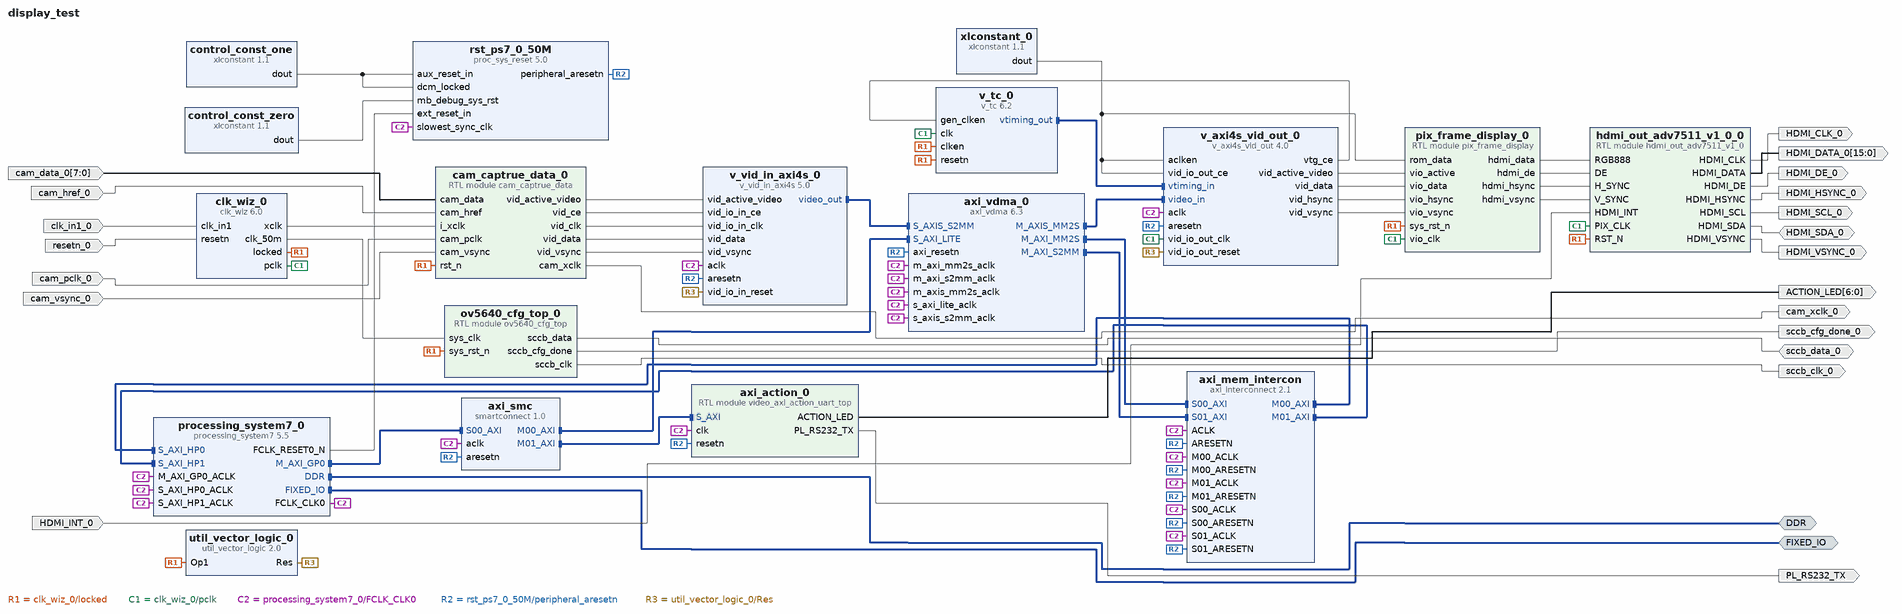
[diagram p0: block diagram of the top level]
# Vivado block design display_test, xc7z020clg484-1, Vivado 2025.2
create_bd_design display_test

create_bd_intf_port -mode Master -vlnv xilinx.com:interface:ddrx_rtl:1.0 DDR
create_bd_intf_port -mode Master -vlnv xilinx.com:display_processing_system7:fixedio_rtl:1.0 FIXED_IO
create_bd_port -dir O -type clk sccb_clk_0
create_bd_port -dir IO sccb_data_0
create_bd_port -dir O sccb_cfg_done_0
create_bd_port -dir I cam_vsync_0
create_bd_port -dir I cam_href_0
create_bd_port -dir I cam_pclk_0
create_bd_port -dir I -from 7 -to 0 cam_data_0
create_bd_port -dir I -type clk clk_in1_0
set_property -dict {CONFIG.FREQ_HZ 100000000} [get_bd_ports clk_in1_0]
create_bd_port -dir I -type rst resetn_0
create_bd_port -dir O cam_xclk_0
create_bd_port -dir O HDMI_SCL_0
create_bd_port -dir O HDMI_DE_0
create_bd_port -dir O -from 15 -to 0 HDMI_DATA_0
create_bd_port -dir I HDMI_INT_0
create_bd_port -dir O HDMI_VSYNC_0
create_bd_port -dir O HDMI_HSYNC_0
create_bd_port -dir O -type clk HDMI_CLK_0
set_property -dict {CONFIG.FREQ_HZ 25000000} [get_bd_ports HDMI_CLK_0]
create_bd_port -dir IO HDMI_SDA_0
create_bd_port -dir O PL_RS232_TX
create_bd_port -dir O -from 6 -to 0 ACTION_LED

create_bd_cell -type ip -vlnv xilinx.com:ip:processing_system7:5.5 processing_system7_0
set_property -dict [list \
  CONFIG.PCW_APU_PERIPHERAL_FREQMHZ 666.666666 \
  CONFIG.PCW_ENET0_ENET0_IO {MIO 16 .. 27} \
  CONFIG.PCW_ENET0_GRP_MDIO_ENABLE 1 \
  CONFIG.PCW_ENET0_GRP_MDIO_IO {MIO 52 .. 53} \
  CONFIG.PCW_ENET0_PERIPHERAL_ENABLE 1 \
  CONFIG.PCW_ENET0_RESET_ENABLE 1 \
  CONFIG.PCW_ENET0_RESET_IO {MIO 47} \
  CONFIG.PCW_ENET_RESET_ENABLE 1 \
  CONFIG.PCW_ENET_RESET_SELECT {Share reset pin} \
  CONFIG.PCW_FPGA0_PERIPHERAL_FREQMHZ 50 \
  CONFIG.PCW_FPGA1_PERIPHERAL_FREQMHZ 50 \
  CONFIG.PCW_GPIO_EMIO_GPIO_ENABLE 1 \
  CONFIG.PCW_GPIO_EMIO_GPIO_IO 2 \
  CONFIG.PCW_GPIO_EMIO_GPIO_WIDTH 2 \
  CONFIG.PCW_GPIO_MIO_GPIO_ENABLE 1 \
  CONFIG.PCW_GPIO_MIO_GPIO_IO MIO \
  CONFIG.PCW_I2C_RESET_ENABLE 1 \
  CONFIG.PCW_PERIPHERAL_BOARD_PRESET None \
  CONFIG.PCW_PRESET_BANK1_VOLTAGE {LVCMOS 1.8V} \
  CONFIG.PCW_QSPI_PERIPHERAL_ENABLE 0 \
  CONFIG.PCW_SD0_GRP_CD_ENABLE 1 \
  CONFIG.PCW_SD0_GRP_CD_IO {MIO 0} \
  CONFIG.PCW_SD0_GRP_WP_ENABLE 0 \
  CONFIG.PCW_SD0_PERIPHERAL_ENABLE 1 \
  CONFIG.PCW_SD0_SD0_IO {MIO 40 .. 45} \
  CONFIG.PCW_SDIO_PERIPHERAL_FREQMHZ 100 \
  CONFIG.PCW_UART1_PERIPHERAL_ENABLE 1 \
  CONFIG.PCW_UART1_UART1_IO {MIO 48 .. 49} \
  CONFIG.PCW_UART_PERIPHERAL_FREQMHZ 100 \
  CONFIG.PCW_UIPARAM_DDR_FREQ_MHZ 533.333333 \
  CONFIG.PCW_UIPARAM_DDR_PARTNO {MT41K256M16 RE-15E} \
  CONFIG.PCW_USB0_PERIPHERAL_ENABLE 0 \
  CONFIG.PCW_USB_RESET_ENABLE 1 \
  CONFIG.PCW_USE_S_AXI_HP0 1 \
  CONFIG.PCW_USE_S_AXI_HP1 1 \
  CONFIG.preset None \
] [get_bd_cells processing_system7_0]
# 497 more settings of processing_system7_0 are not shown: defaults, MIO pin electricals, DDR timing, and values the tool derives
create_bd_cell -type module -reference ov5640_cfg_top ov5640_cfg_top_0
create_bd_cell -type module -reference cam_captrue_data cam_captrue_data_0
create_bd_cell -type ip -vlnv xilinx.com:ip:axi_vdma:6.3 axi_vdma_0
set_property -dict [list \
  CONFIG.c_m_axis_mm2s_tdata_width 24 \
  CONFIG.c_mm2s_linebuffer_depth 1024 \
  CONFIG.c_s2mm_linebuffer_depth 1024 \
] [get_bd_cells axi_vdma_0]
create_bd_cell -type ip -vlnv xilinx.com:ip:v_vid_in_axi4s:5.0 v_vid_in_axi4s_0
set_property -dict {CONFIG.C_ADDR_WIDTH 13 CONFIG.C_HAS_ASYNC_CLK 1} [get_bd_cells v_vid_in_axi4s_0]
create_bd_cell -type ip -vlnv xilinx.com:ip:v_axi4s_vid_out:4.0 v_axi4s_vid_out_0
set_property -dict {CONFIG.C_ADDR_WIDTH 13 CONFIG.C_HAS_ASYNC_CLK 1} [get_bd_cells v_axi4s_vid_out_0]
create_bd_cell -type module -reference pix_frame_display pix_frame_display_0
create_bd_cell -type ip -vlnv xilinx.com:ip:clk_wiz:6.0 clk_wiz_0
set_property -dict [list \
  CONFIG.CLKIN1_JITTER_PS 100.0 \
  CONFIG.CLKOUT1_DRIVES BUFG \
  CONFIG.CLKOUT1_JITTER 172.753 \
  CONFIG.CLKOUT1_PHASE_ERROR 150.621 \
  CONFIG.CLKOUT1_REQUESTED_OUT_FREQ 25 \
  CONFIG.CLKOUT2_DRIVES BUFG \
  CONFIG.CLKOUT2_JITTER 126.824 \
  CONFIG.CLKOUT2_PHASE_ERROR 150.621 \
  CONFIG.CLKOUT2_REQUESTED_OUT_FREQ 125 \
  CONFIG.CLKOUT2_USED true \
  CONFIG.CLKOUT3_DRIVES BUFG \
  CONFIG.CLKOUT3_JITTER 174.298 \
  CONFIG.CLKOUT3_PHASE_ERROR 150.621 \
  CONFIG.CLKOUT3_REQUESTED_OUT_FREQ 24 \
  CONFIG.CLKOUT3_USED true \
  CONFIG.CLKOUT4_DRIVES BUFG \
  CONFIG.CLKOUT4_JITTER 149.175 \
  CONFIG.CLKOUT4_PHASE_ERROR 150.621 \
  CONFIG.CLKOUT4_REQUESTED_OUT_FREQ 50 \
  CONFIG.CLKOUT4_USED true \
  CONFIG.CLKOUT5_DRIVES BUFG \
  CONFIG.CLKOUT6_DRIVES BUFG \
  CONFIG.CLKOUT7_DRIVES BUFG \
  CONFIG.CLK_OUT1_PORT pclk \
  CONFIG.CLK_OUT2_PORT pclk_x5 \
  CONFIG.CLK_OUT3_PORT xclk \
  CONFIG.CLK_OUT4_PORT clk_50m \
  CONFIG.MMCM_BANDWIDTH OPTIMIZED \
  CONFIG.MMCM_CLKFBOUT_MULT_F 25 \
  CONFIG.MMCM_CLKIN1_PERIOD 10.000 \
  CONFIG.MMCM_CLKIN2_PERIOD 10.000 \
  CONFIG.MMCM_CLKOUT0_DIVIDE_F 50 \
  CONFIG.MMCM_CLKOUT1_DIVIDE 10 \
  CONFIG.MMCM_CLKOUT2_DIVIDE 52 \
  CONFIG.MMCM_CLKOUT3_DIVIDE 25 \
  CONFIG.MMCM_COMPENSATION ZHOLD \
  CONFIG.MMCM_DIVCLK_DIVIDE 2 \
  CONFIG.NUM_OUT_CLKS 4 \
  CONFIG.PLL_CLKIN_PERIOD 10.000 \
  CONFIG.PLL_COMPENSATION SYSTEM_SYNCHRONOUS \
  CONFIG.PRIMITIVE PLL \
  CONFIG.PRIM_IN_FREQ 100 \
  CONFIG.RESET_PORT resetn \
  CONFIG.RESET_TYPE ACTIVE_LOW \
] [get_bd_cells clk_wiz_0]
create_bd_cell -type ip -vlnv xilinx.com:ip:v_tc:6.2 v_tc_0
set_property -dict [list \
  CONFIG.GEN_HSYNC_POLARITY High \
  CONFIG.GEN_VSYNC_POLARITY High \
  CONFIG.HAS_AXI4_LITE false \
  CONFIG.VIDEO_MODE 480p \
  CONFIG.enable_detection false \
] [get_bd_cells v_tc_0]
create_bd_cell -type ip -vlnv xilinx.com:ip:xlconstant:1.1 xlconstant_0
create_bd_cell -type ip -vlnv xilinx.com:ip:util_vector_logic:2.0 util_vector_logic_0
set_property -dict {CONFIG.C_OPERATION not CONFIG.C_SIZE 1} [get_bd_cells util_vector_logic_0]
create_bd_cell -type ip -vlnv xilinx.com:ip:smartconnect:1.0 axi_smc
set_property -dict {CONFIG.NUM_MI 2 CONFIG.NUM_SI 1} [get_bd_cells axi_smc]
create_bd_cell -type ip -vlnv xilinx.com:ip:proc_sys_reset:5.0 rst_ps7_0_50M
create_bd_cell -type ip -vlnv xilinx.com:ip:axi_interconnect:2.1 axi_mem_intercon
set_property -dict {CONFIG.NUM_MI 2 CONFIG.NUM_SI 2} [get_bd_cells axi_mem_intercon]
create_bd_cell -type module -reference hdmi_out_adv7511_v1_0 hdmi_out_adv7511_v1_0_0
create_bd_cell -type ip -vlnv xilinx.com:ip:xlconstant:1.1 control_const_one
set_property -dict {CONFIG.CONST_VAL 1} [get_bd_cells control_const_one]
create_bd_cell -type ip -vlnv xilinx.com:ip:xlconstant:1.1 control_const_zero
set_property -dict {CONFIG.CONST_VAL 0} [get_bd_cells control_const_zero]
create_bd_cell -type module -reference video_axi_action_uart_top axi_action_0

# ---- connections ----

connect_bd_intf_net [get_bd_intf_pins axi_mem_intercon/M00_AXI] [get_bd_intf_pins processing_system7_0/S_AXI_HP0]
connect_bd_intf_net [get_bd_intf_pins processing_system7_0/S_AXI_HP1] [get_bd_intf_pins axi_mem_intercon/M01_AXI]
connect_bd_intf_net [get_bd_intf_pins axi_smc/M00_AXI] [get_bd_intf_pins axi_vdma_0/S_AXI_LITE]
connect_bd_intf_net [get_bd_intf_pins axi_smc/M01_AXI] [get_bd_intf_pins axi_action_0/S_AXI]
connect_bd_intf_net [get_bd_intf_pins v_axi4s_vid_out_0/video_in] [get_bd_intf_pins axi_vdma_0/M_AXIS_MM2S]
connect_bd_intf_net [get_bd_intf_pins axi_vdma_0/M_AXI_MM2S] [get_bd_intf_pins axi_mem_intercon/S00_AXI]
connect_bd_intf_net [get_bd_intf_pins axi_vdma_0/M_AXI_S2MM] [get_bd_intf_pins axi_mem_intercon/S01_AXI]
connect_bd_intf_net [get_bd_intf_ports DDR] [get_bd_intf_pins processing_system7_0/DDR]
connect_bd_intf_net [get_bd_intf_ports FIXED_IO] [get_bd_intf_pins processing_system7_0/FIXED_IO]
connect_bd_intf_net [get_bd_intf_pins processing_system7_0/M_AXI_GP0] [get_bd_intf_pins axi_smc/S00_AXI]
connect_bd_intf_net [get_bd_intf_pins v_tc_0/vtiming_out] [get_bd_intf_pins v_axi4s_vid_out_0/vtiming_in]
connect_bd_intf_net [get_bd_intf_pins v_vid_in_axi4s_0/video_out] [get_bd_intf_pins axi_vdma_0/S_AXIS_S2MM]
connect_bd_net -net HDMI_INT_0_1 [get_bd_ports HDMI_INT_0] [get_bd_pins hdmi_out_adv7511_v1_0_0/HDMI_INT]
connect_bd_net [get_bd_ports sccb_data_0] [get_bd_pins ov5640_cfg_top_0/sccb_data]
connect_bd_net [get_bd_pins xlconstant_0/dout] \
  [get_bd_pins v_axi4s_vid_out_0/vid_io_out_ce] [get_bd_pins v_axi4s_vid_out_0/aclken] \
  [get_bd_pins pix_frame_display_0/rom_data]
connect_bd_net [get_bd_ports HDMI_SDA_0] [get_bd_pins hdmi_out_adv7511_v1_0_0/HDMI_SDA]
connect_bd_net [get_bd_pins axi_action_0/ACTION_LED] [get_bd_ports ACTION_LED]
connect_bd_net [get_bd_pins axi_action_0/PL_RS232_TX] [get_bd_ports PL_RS232_TX]
connect_bd_net [get_bd_pins cam_captrue_data_0/cam_xclk] [get_bd_ports cam_xclk_0]
connect_bd_net [get_bd_pins cam_captrue_data_0/vid_active_video] [get_bd_pins v_vid_in_axi4s_0/vid_active_video]
connect_bd_net [get_bd_pins cam_captrue_data_0/vid_ce] [get_bd_pins v_vid_in_axi4s_0/vid_io_in_ce]
connect_bd_net [get_bd_pins cam_captrue_data_0/vid_clk] [get_bd_pins v_vid_in_axi4s_0/vid_io_in_clk]
connect_bd_net [get_bd_pins cam_captrue_data_0/vid_data] [get_bd_pins v_vid_in_axi4s_0/vid_data]
connect_bd_net [get_bd_pins cam_captrue_data_0/vid_vsync] [get_bd_pins v_vid_in_axi4s_0/vid_vsync]
connect_bd_net -net cam_data_0_1 [get_bd_ports cam_data_0] [get_bd_pins cam_captrue_data_0/cam_data]
connect_bd_net -net cam_href_0_1 [get_bd_ports cam_href_0] [get_bd_pins cam_captrue_data_0/cam_href]
connect_bd_net -net cam_pclk_0_1 [get_bd_ports cam_pclk_0] [get_bd_pins cam_captrue_data_0/cam_pclk]
connect_bd_net -net cam_vsync_0_1 [get_bd_ports cam_vsync_0] [get_bd_pins cam_captrue_data_0/cam_vsync]
connect_bd_net -net clk_in1_0_1 [get_bd_ports clk_in1_0] [get_bd_pins clk_wiz_0/clk_in1]
connect_bd_net [get_bd_pins clk_wiz_0/clk_50m] [get_bd_pins ov5640_cfg_top_0/sys_clk]
connect_bd_net [get_bd_pins clk_wiz_0/locked] \
  [get_bd_pins cam_captrue_data_0/rst_n] [get_bd_pins util_vector_logic_0/Op1] [get_bd_pins ov5640_cfg_top_0/sys_rst_n] \
  [get_bd_pins v_tc_0/resetn] [get_bd_pins v_tc_0/clken] [get_bd_pins hdmi_out_adv7511_v1_0_0/RST_N] \
  [get_bd_pins pix_frame_display_0/sys_rst_n]
connect_bd_net [get_bd_pins clk_wiz_0/pclk] \
  [get_bd_pins v_tc_0/clk] [get_bd_pins v_axi4s_vid_out_0/vid_io_out_clk] [get_bd_pins hdmi_out_adv7511_v1_0_0/PIX_CLK] \
  [get_bd_pins pix_frame_display_0/vio_clk]
connect_bd_net [get_bd_pins clk_wiz_0/xclk] [get_bd_pins cam_captrue_data_0/i_xclk]
connect_bd_net [get_bd_pins control_const_one/dout] [get_bd_pins rst_ps7_0_50M/aux_reset_in] [get_bd_pins rst_ps7_0_50M/dcm_locked]
connect_bd_net [get_bd_pins control_const_zero/dout] [get_bd_pins rst_ps7_0_50M/mb_debug_sys_rst]
connect_bd_net [get_bd_pins hdmi_out_adv7511_v1_0_0/HDMI_CLK] [get_bd_ports HDMI_CLK_0]
connect_bd_net [get_bd_pins hdmi_out_adv7511_v1_0_0/HDMI_DATA] [get_bd_ports HDMI_DATA_0]
connect_bd_net [get_bd_pins hdmi_out_adv7511_v1_0_0/HDMI_DE] [get_bd_ports HDMI_DE_0]
connect_bd_net [get_bd_pins hdmi_out_adv7511_v1_0_0/HDMI_HSYNC] [get_bd_ports HDMI_HSYNC_0]
connect_bd_net [get_bd_pins hdmi_out_adv7511_v1_0_0/HDMI_SCL] [get_bd_ports HDMI_SCL_0]
connect_bd_net [get_bd_pins hdmi_out_adv7511_v1_0_0/HDMI_VSYNC] [get_bd_ports HDMI_VSYNC_0]
connect_bd_net [get_bd_pins ov5640_cfg_top_0/sccb_cfg_done] [get_bd_ports sccb_cfg_done_0]
connect_bd_net [get_bd_pins ov5640_cfg_top_0/sccb_clk] [get_bd_ports sccb_clk_0]
connect_bd_net [get_bd_pins pix_frame_display_0/hdmi_data] [get_bd_pins hdmi_out_adv7511_v1_0_0/RGB888]
connect_bd_net [get_bd_pins pix_frame_display_0/hdmi_de] [get_bd_pins hdmi_out_adv7511_v1_0_0/DE]
connect_bd_net [get_bd_pins pix_frame_display_0/hdmi_hsync] [get_bd_pins hdmi_out_adv7511_v1_0_0/H_SYNC]
connect_bd_net [get_bd_pins pix_frame_display_0/hdmi_vsync] [get_bd_pins hdmi_out_adv7511_v1_0_0/V_SYNC]
connect_bd_net [get_bd_pins processing_system7_0/FCLK_CLK0] \
  [get_bd_pins axi_vdma_0/m_axis_mm2s_aclk] [get_bd_pins v_axi4s_vid_out_0/aclk] \
  [get_bd_pins processing_system7_0/M_AXI_GP0_ACLK] [get_bd_pins axi_smc/aclk] [get_bd_pins axi_vdma_0/s_axi_lite_aclk] \
  [get_bd_pins rst_ps7_0_50M/slowest_sync_clk] [get_bd_pins axi_vdma_0/s_axis_s2mm_aclk] [get_bd_pins v_vid_in_axi4s_0/aclk] \
  [get_bd_pins axi_vdma_0/m_axi_mm2s_aclk] [get_bd_pins axi_mem_intercon/S00_ACLK] \
  [get_bd_pins processing_system7_0/S_AXI_HP0_ACLK] [get_bd_pins axi_mem_intercon/M00_ACLK] \
  [get_bd_pins axi_mem_intercon/ACLK] [get_bd_pins axi_vdma_0/m_axi_s2mm_aclk] [get_bd_pins axi_mem_intercon/S01_ACLK] \
  [get_bd_pins axi_mem_intercon/M01_ACLK] [get_bd_pins processing_system7_0/S_AXI_HP1_ACLK] [get_bd_pins axi_action_0/clk]
connect_bd_net [get_bd_pins processing_system7_0/FCLK_RESET0_N] [get_bd_pins rst_ps7_0_50M/ext_reset_in]
connect_bd_net -net resetn_0_1 [get_bd_ports resetn_0] [get_bd_pins clk_wiz_0/resetn]
connect_bd_net [get_bd_pins rst_ps7_0_50M/peripheral_aresetn] \
  [get_bd_pins axi_vdma_0/axi_resetn] [get_bd_pins axi_smc/aresetn] [get_bd_pins axi_mem_intercon/S00_ARESETN] \
  [get_bd_pins axi_mem_intercon/M00_ARESETN] [get_bd_pins axi_mem_intercon/ARESETN] \
  [get_bd_pins axi_mem_intercon/S01_ARESETN] [get_bd_pins axi_mem_intercon/M01_ARESETN] \
  [get_bd_pins v_axi4s_vid_out_0/aresetn] [get_bd_pins v_vid_in_axi4s_0/aresetn] [get_bd_pins axi_action_0/resetn]
connect_bd_net [get_bd_pins util_vector_logic_0/Res] [get_bd_pins v_vid_in_axi4s_0/vid_io_in_reset] [get_bd_pins v_axi4s_vid_out_0/vid_io_out_reset]
connect_bd_net [get_bd_pins v_axi4s_vid_out_0/vid_active_video] [get_bd_pins pix_frame_display_0/vio_active]
connect_bd_net [get_bd_pins v_axi4s_vid_out_0/vid_data] [get_bd_pins pix_frame_display_0/vio_data]
connect_bd_net [get_bd_pins v_axi4s_vid_out_0/vid_hsync] [get_bd_pins pix_frame_display_0/vio_hsync]
connect_bd_net [get_bd_pins v_axi4s_vid_out_0/vid_vsync] [get_bd_pins pix_frame_display_0/vio_vsync]
connect_bd_net [get_bd_pins v_axi4s_vid_out_0/vtg_ce] [get_bd_pins v_tc_0/gen_clken]

# ---- address map ----
assign_bd_address -offset 0x00000000 -range 256M -target_address_space [get_bd_addr_spaces axi_vdma_0/Data_MM2S] [get_bd_addr_segs processing_system7_0/S_AXI_HP0/HP0_DDR_LOWOCM]
assign_bd_address -offset 0x10000000 -range 256M -target_address_space [get_bd_addr_spaces axi_vdma_0/Data_MM2S] [get_bd_addr_segs processing_system7_0/S_AXI_HP1/HP1_DDR_LOWOCM]
assign_bd_address -offset 0x00000000 -range 256M -target_address_space [get_bd_addr_spaces axi_vdma_0/Data_S2MM] [get_bd_addr_segs processing_system7_0/S_AXI_HP0/HP0_DDR_LOWOCM]
assign_bd_address -offset 0x10000000 -range 256M -target_address_space [get_bd_addr_spaces axi_vdma_0/Data_S2MM] [get_bd_addr_segs processing_system7_0/S_AXI_HP1/HP1_DDR_LOWOCM]
assign_bd_address -offset 0x43000000 -range 64K -target_address_space [get_bd_addr_spaces processing_system7_0/Data] [get_bd_addr_segs axi_vdma_0/S_AXI_LITE/Reg]
assign_bd_address -offset 0x43C00000 -range 4K -target_address_space [get_bd_addr_spaces processing_system7_0/Data] [get_bd_addr_segs axi_action_0/S_AXI/reg0]

validate_bd_design
save_bd_design
